# EAGLE design SUSTAINA-SCI-Extension-Board (EAGLE 9.6.2)
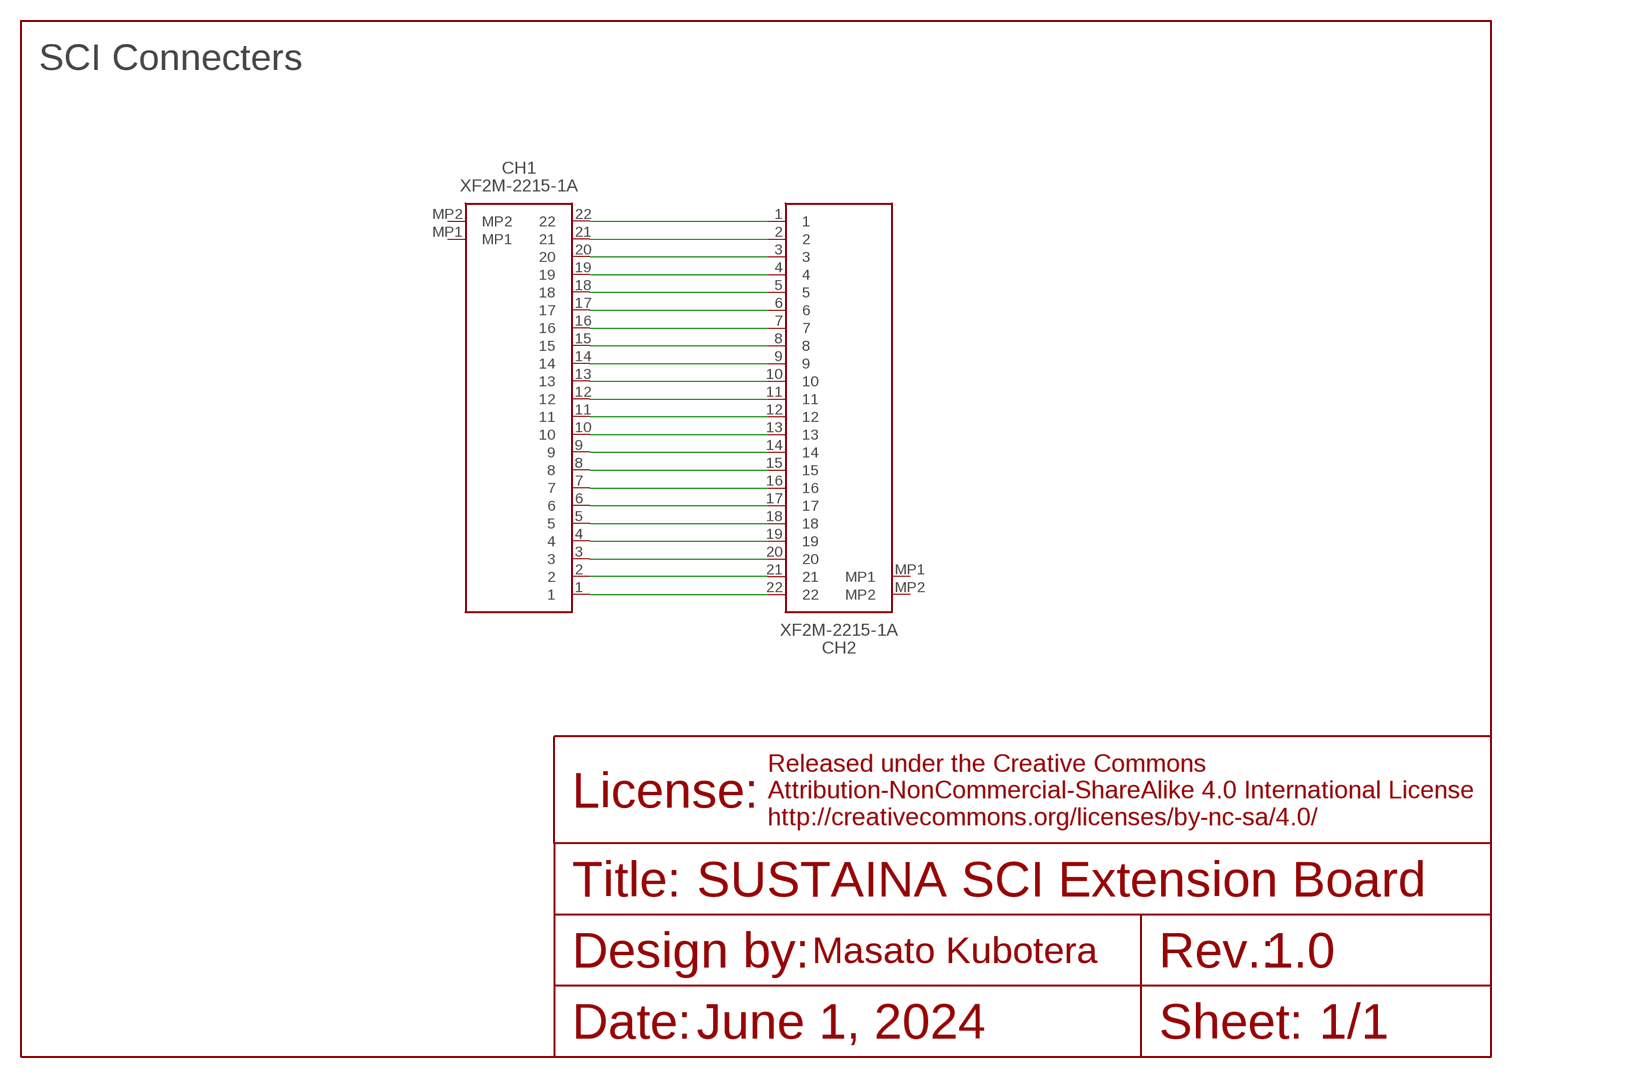
[diagram p0: schematic, sheet 1]

## Parts
CH1  XF2M-2215-1A  [XF2M-2215-1A]
CH2  XF2M-2215-1A  [XF2M-2215-1A]

## Nets
N$1 [single]: CH1.22 CH2.1
N$2 [single]: CH1.21 CH2.2
N$3 [single]: CH1.20 CH2.3
N$4 [single]: CH1.19 CH2.4
N$5 [single]: CH1.18 CH2.5
N$6 [single]: CH1.17 CH2.6
N$7 [single]: CH1.16 CH2.7
N$8 [single]: CH1.15 CH2.8
N$9 [single]: CH1.14 CH2.9
N$10 [single]: CH1.13 CH2.10
N$11 [single]: CH1.12 CH2.11
N$12 [single]: CH1.11 CH2.12
N$13 [single]: CH1.10 CH2.13
N$14 [single]: CH1.9 CH2.14
N$15 [single]: CH1.8 CH2.15
N$16 [single]: CH1.7 CH2.16
N$17 [single]: CH1.6 CH2.17
N$18 [single]: CH1.5 CH2.18
N$19 [single]: CH1.4 CH2.19
N$20 [single]: CH1.2 CH2.21
N$21 [single]: CH1.3 CH2.20
N$22 [single]: CH1.1 CH2.22
Unconnected: CH1.MP1 CH1.MP2 CH2.MP1 CH2.MP2

## Notes on the sheet
- SCI Connecters
- SUSTAINA SCI Extension Board
- 1.0
- June 1, 2024 | 1/1

## Library data of the parts
CH1 CH2 = XF2M-2215-1A:XF2M-2215-1A

## Net classes
1 single: width 0.254 mm

## Board
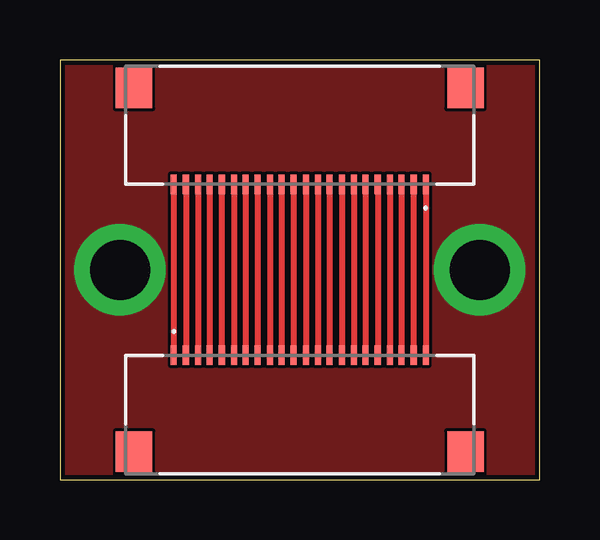
[diagram p1: board, top side]
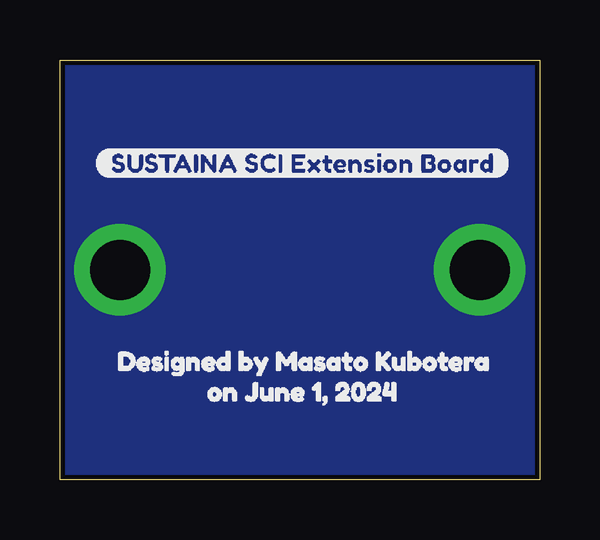
[diagram p2: board, bottom side, seen from below]

Size 20 x 17.5 mm. Coordinates in mm from the lower left corner, seen from the top.
Outline: 0,17.5 0,0 20,0 20,17.5 0,17.5
Copper layers (1*16): Top 0.035mm / dielectric 1.6mm / Bottom 0.035mm
Design rules "jlcpcb-2layers": minimum track width 5mil, minimum drill 0.3mm, track to track 5mil, track to pad 5mil, pad to pad 5mil, via to via 5mil, smd to smd 5mil, copper to edge 0.2mm, drill to drill 6mil, minimum pad ring 10mil, minimum via ring 3mil, stop-mask expansion 4mil, vias tented up to drill 0mil, thermal gap 10mil

### Footprints (pad centres in the part's own frame; a part is rotated, then mirrored left to right if it is on the bottom)
XF2M-2215-1A = smd 0.254 x 0.813: 1 -5.258,4.928; 2 -4.75,4.928; 3 -4.242,4.928; 4 -3.759,4.928; 5 -3.251,4.928; 6 -2.743,4.928; 7 -2.261,4.928; 8 -1.753,4.928; 9 -1.245,4.928; 10 -0.762,4.928; 11 -0.254,4.928; 12 0.254,4.928; 13 0.762,4.928; 14 1.245,4.928; 15 1.753,4.928; 16 2.261,4.928; 17 2.743,4.928; 18 3.251,4.928; 19 3.759,4.928; 20 4.242,4.928; 21 4.75,4.928; 22 5.258,4.928 | smd 1.524 x 1.702: MP1 -6.909,0.914; MP2 6.909,0.914

### Placement (x,y rotation side)
CH1  10,17.25 180 top
CH2  10,0.25 0 top
U$1  [SUSTAINA_SCI_EXTENSION_BOARD-0.03]  18.57,13.2 0 bottom
U$2  [DESIGNED_BY_MASATO_KUBOTERA_ON_JUNE_1-0.03]  10,4.94 0 bottom

### Tracks (layer width: path | path; a pad name or v marks a point on that pad's centre or on a via)
GND  (via drill 2.5 pad 3.8)
  other vias: 2.5,8.75 17.5,8.75
  pour Top: -1.43,17.64 -1.43,-0.14 21.43,-0.14 21.43,17.64
  pour Bottom: -2.7,18.91 -2.7,-1.41 22.7,-1.41 22.7,18.91
N$1
  Top 0.254: CH1.22 CH2.1
N$2
  Top 0.254: CH1.21 CH2.2
N$3
  Top 0.254: CH1.20 CH2.3
N$4
  Top 0.254: CH1.19 CH2.4
N$5
  Top 0.254: CH1.18 CH2.5
N$6
  Top 0.254: CH1.17 CH2.6
N$7
  Top 0.254: CH1.16 CH2.7
N$8
  Top 0.254: CH1.15 CH2.8
N$9
  Top 0.254: CH1.14 CH2.9
N$10
  Top 0.254: CH1.13 CH2.10
N$11
  Top 0.254: CH1.12 CH2.11
N$12
  Top 0.254: CH1.11 CH2.12
N$13
  Top 0.254: CH1.10 CH2.13
N$14
  Top 0.254: CH1.9 CH2.14
N$15
  Top 0.254: CH1.8 CH2.15
N$16
  Top 0.254: CH1.7 CH2.16
N$17
  Top 0.254: CH1.6 CH2.17
N$18
  Top 0.254: CH1.5 CH2.18
N$19
  Top 0.254: CH1.4 CH2.19
N$20
  Top 0.254: CH1.2 CH2.21
N$21
  Top 0.254: CH1.3 CH2.20
N$22
  Top 0.254: CH1.1 CH2.22